# Altium schematic sheet OPID[351] 5V Step-down regulator v2.SchDoc
size A3; Author: Andreas Tesaker; CompanyName: VORTEX NTNU; Revision: A
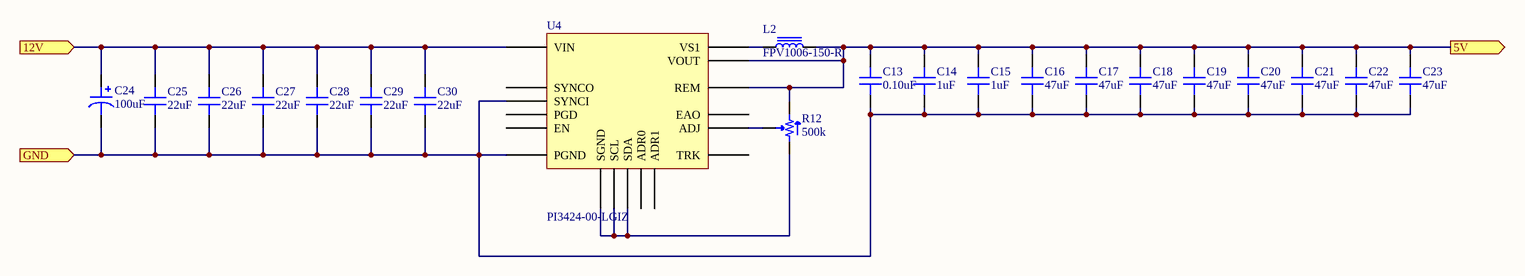
[diagram p0: OPID[351] 5V Step-down regulator v2.SchDoc]

## Parts
C13  0.10uF  [CAP 1206/3216 - 1.0MM]
C14  1uF  [CAP 0603/1608]
C15  1uF  [CAP 0603/1608]
C16  47uF  [CAP 1206/3216]
C17  47uF  [CAP 1206/3216]
C18  47uF  [CAP 1206/3216]
C19  47uF  [CAP 1206/3216]
C20  47uF  [CAP 1206/3216]
C21  47uF  [CAP 1206/3216]
C22  47uF  [CAP 1206/3216]
C23  47uF  [CAP 1206/3216]
C24  100uF  [CAP ALUM 10.3MM]
C25  22uF  [CAP 1206/3216]
C26  22uF  [CAP 1206/3216]
C27  22uF  [CAP 1206/3216]
C28  22uF  [CAP 1206/3216]
C29  22uF  [CAP 1206/3216]
C30  22uF  [CAP 1206/3216]
L2  FPV1006-150-R  [FPV1006-150-R]
R12  500k  [POT Panasonic EVM]
U4  PI3424-00-LGIZ  [PI34xx-00]

## Ports
5V (out), 12V (in), GND (in)

## Nets
5V: C13.2 C14.2 C15.2 C16.2 C17.2 C18.2 C19.2 C20.2 C21.2 C22.2 C23.2 L2.2 R12.3 U4.REM U4.VOUT ; port 5V
12V: C24.1 C25.2 C26.2 C27.2 C28.2 C29.2 C30.2 U4.VIN ; port 12V
GND: C13.1 C14.1 C15.1 C16.1 C17.1 C18.1 C19.1 C20.1 C21.1 C22.1 C23.1 C24.2 C25.1 C26.1 C27.1 C28.1 C29.1 C30.1 U4.PGND U4.SYNCI ; port GND
NetL2_1: L2.1 U4.VS1
NetR12_1: R12.1 U4.SCL U4.SDA U4.SGND
NetR12_2: R12.2 U4.ADJ

Not connected (* = marked no-connect by the designer): U4 ADR0 ADR1 EAO EN PGD SYNCO TRK

## Notes on the sheet
- Title
- Size
- Author
- Rev
- A3
- Sheet no.
- of

## Library data of the parts
C13 = GRM319R71H104KA01D: CAP CER 0.1UF 50V X7R 1206; Manufacturer: Murata Electronics North America; TemperatureRange: -55C ~ 125C; Tolerance: 10%; Value: 0.10uF; Part Number: GRM319R71H104KA01D; PartId: 16942; Supplier 1: Digi-Key; Supplier Part Number 1: 490-1775-2-ND; ComponentLink1Description: Datasheet; ComponentLink1URL: http://www.murata.com/~/media/webrenewal/support/library/catalog/products/capacitor/mlcc/c02e.pdf; ComponentLink2Description: Digi-Key Listing; ComponentLink2URL: https://www.digikey.com/product-detail/en/murata-electronics-north-america/GRM319R71H104KA01D/490-1775-2-ND/586815; TemperatureCoefficient: X7R; Voltage: 50V; Price: 0,0231; Device Package: 1206 (3216 Metric)
C14 C15 = GRM188R71C105KA12D: CAP CER 1UF 16V X7R 0603; Manufacturer: Murata Electronics North America; TemperatureRange: -55C ~ 125C; Tolerance: 10%; Value: 1uF; Part Number: GRM188R71C105KA12D; PartId: 12965; Supplier 1: Digi-Key; Supplier Part Number 1: 490-3900-2-ND; ComponentLink1Description: Datasheet; ComponentLink1URL: http://www.murata.com/~/media/webrenewal/support/library/catalog/products/capacitor/mlcc/c02e.pdf; ComponentLink2Description: Digi-Key Listing; ComponentLink2URL: https://www.digikey.com/product-detail/en/murata-electronics-north-america/GRM188R71C105KA12D/490-3900-2-ND/965914; TemperatureCoefficient: X7R; Voltage: 16V; Price: 0,014; Device Package: 0603 (1608 Metric)
C16-C23 = GRM31CR61A476ME15L: CAP CER 47UF 10V X5R 1206; Manufacturer: Murata Electronics North America; TemperatureRange: -55C ~ 85C; Tolerance: 20%; Value: 47uF; Part Number: GRM31CR61A476ME15L; PartId: 15800; Supplier 1: Digi-Key; Supplier Part Number 1: 490-5528-2-ND; ComponentLink1Description: Datasheet; ComponentLink1URL: http://www.murata.com/~/media/webrenewal/support/library/catalog/products/capacitor/mlcc/c02e.pdf; ComponentLink2Description: Digi-Key Listing; ComponentLink2URL: https://www.digikey.com/product-detail/en/murata-electronics-north-america/GRM31CR61A476ME15L/490-5528-2-ND/2334879; TemperatureCoefficient: X5R; Voltage: 10V; Price: 0,2053; Device Package: 1206 (3216 Metric)
C24 = UUX1H101MNL1GS: CAP ALUM 100UF 20% 50V SMD; Manufacturer: Nichicon; TemperatureRange: -55C ~ 105C; Type: General Purpose; Ripple Current: 310mA; Lifetime @ Temp: 2000 Hrs @ 105C; Value: 100uF; Part Number: UUX1H101MNL1GS; PartId: 7391; Supplier 1: Digi-Key; Supplier Part Number 1: 493-6269-2-ND; ComponentLink1Description: Datasheet; ComponentLink1URL: http://nichicon-us.com/english/products/pdfs/e-ux.pdf; ComponentLink2Description: Digi-Key listing; ComponentLink2URL: http://digikey.com/product-detail/en/UUX1H101MNL1GS/493-6269-2-ND/2550537; Tolerance: 20%; Voltage: 50V; Price: 0,2791; Device Package: Radial, Can - SMD; Impedance: -
C25-C30 = GRM31CR61E226KE15L: CAP CER 22UF 25V X5R 1206; Manufacturer: Murata Electronics North America; TemperatureRange: -55C ~ 85C; Tolerance: 10%; Value: 22uF; Part Number: GRM31CR61E226KE15L; PartId: 15793; Supplier 1: Digi-Key; Supplier Part Number 1: 490-5527-2-ND; ComponentLink1Description: Datasheet; ComponentLink1URL: http://www.murata.com/~/media/webrenewal/support/library/catalog/products/capacitor/mlcc/c02e.pdf; ComponentLink2Description: Digi-Key Listing; ComponentLink2URL: https://www.digikey.com/product-detail/en/murata-electronics-north-america/GRM31CR61E226KE15L/490-5527-2-ND/2334878; TemperatureCoefficient: X5R; Voltage: 25V; Price: 0,1785; Device Package: 1206 (3216 Metric)
L2 = FPV1006-150-R: FIXED IND 150NH 25A 0.41 MOHM; Irms: 25; Part Number: FPV1006-150-R; Value: 150nH; ComponentLink1Description: Manufacturer Link; ComponentLink1URL: http://www.eaton.no/EatonNO/index.htm; ComponentLink2Description: Datasheet; ComponentLink2URL: http://www.cooperindustries.com/content/dam/public/bussmann/Electronics/Resources/product-datasheets/bus-elx-ds-10390-fpv1006.pdf; Supplier 1: Digi-Key; Supplier Part Number 1: 283-4578-2-ND
R12 = EVM-3YSX50B55: TRIMMER 500K OHM 0.15W SMD; Manufacturer: Panasonic Electronic Components; TemperatureCoefficient: 250ppm/C; Tolerance: 25%; Number Of Turns: Single; Adjustment Type: Top Adjustment; Value: 500k; Part Number: EVM-3YSX50B55; PartId: 7181; Supplier 1: Digi-Key; Supplier Part Number 1: P3Y504TR-ND; ComponentLink1Description: Datasheet; ComponentLink1URL: http://media.digikey.com/pdf/Data%20Sheets/Panasonic%20Resistors%20Thermistors%20PDFs/EVM-3Y_S_R_Rev2010.pdf; ComponentLink2Description: Digi-Key Listing; ComponentLink2URL: http://www.digikey.ca/product-detail/en/EVM-3YSX50B55/P3Y504TR-ND/259783; PowerRating: 0.15W; Price: 0,2543; Type: Surface Mount
U4 = PI3424-00-LGIZ: Vin,min: 8V; Vin,max: 18V; Vout,nom: 5V; Iout,max: 15A; Part Number: PI3424-00-LGIZ; ComponentLink1Description: Manufacturer Link; ComponentLink1URL: http://www.vicorpower.com/; ComponentLink2Description: Datasheet; ComponentLink2URL: http://vicorpower.com/documents/datasheets/Picor/ds_pi34xx-00.pdf; Supplier 1: Digi-Key; Supplier Part Number 1: 1102-1641-ND